# Altium schematic sheet Connector.SchDoc
size A4; Organization: PERT; SheetNumber: 3; SheetTotal: 3; Sub Team: EEE
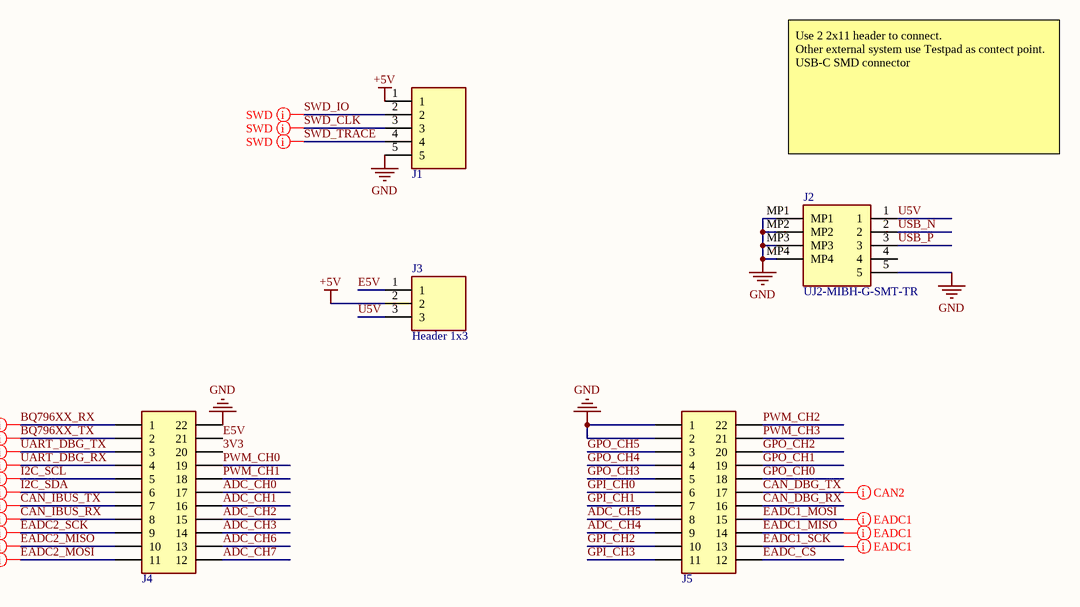
[diagram p0: Connector.SchDoc]

## Parts
J1  Header 1x5  [HDR_1X5_2.54_SMD]  (value not drawn)
J2  UJ2-MIBH-G-SMT-TR  [USB_B_5P_SMD]
J3  Header 1x3  [HDR_1X3_2.54_THD]
J4  Header 1x5  [HDR_2x11_2.54_THD]  (value not drawn)
J5  Header 1x5  [HDR_2x11_2.54_THD]  (value not drawn)

## Nets
+5V: J1.1 J3.2
GND: J1.5 J2.5 J2.MP1 J2.MP2 J2.MP3 J2.MP4 J4.22 J5.1 J5.2
3V3: J4.20
ADC_CH0: J4.17
ADC_CH1: J4.16
ADC_CH2: J4.15
ADC_CH3: J4.14
ADC_CH4: J5.9
ADC_CH5: J5.8
ADC_CH6: J4.13
ADC_CH7: J4.12
BQ796XX_RX: J4.1
BQ796XX_TX: J4.2
CAN_DBG_RX: J5.16
CAN_DBG_TX: J5.17
CAN_IBUS_RX: J4.8
CAN_IBUS_TX: J4.7
E5V: J3.1 J4.21
EADC1_MISO: J5.14
EADC1_MOSI: J5.15
EADC1_SCK: J5.13
EADC2_MISO: J4.10
EADC2_MOSI: J4.11
EADC2_SCK: J4.9
EADC_CS: J5.12
GPI_CH0: J5.6
GPI_CH1: J5.7
GPI_CH2: J5.10
GPI_CH3: J5.11
GPO_CH0: J5.18
GPO_CH1: J5.19
GPO_CH2: J5.20
GPO_CH3: J5.5
GPO_CH4: J5.4
GPO_CH5: J5.3
I2C_SCL: J4.5
I2C_SDA: J4.6
PWM_CH0: J4.19
PWM_CH1: J4.18
PWM_CH2: J5.22
PWM_CH3: J5.21
SWD_CLK: J1.3
SWD_IO: J1.2
SWD_TRACE: J1.4
U5V: J2.1 J3.3
UART_DBG_RX: J4.4
UART_DBG_TX: J4.3
USB_N: J2.2
USB_P: J2.3

Not connected (* = marked no-connect by the designer): J2 4

## Layout directives
net class UART2; rule Matched Net Lengths [Tolerance = 1mm]: UART_DBG_RX, UART_DBG_TX
net class UART1; rule Matched Net Lengths [Tolerance = 1mm]: BQ796XX_RX, BQ796XX_TX
net class I2C; rule Matched Net Lengths [Tolerance = 1mm]: I2C_SCL, I2C_SDA
net class SWD; rule Matched Net Lengths [Tolerance = 1mm]: SWD_CLK, SWD_IO, SWD_TRACE
net class EADC1; rule Matched Net Lengths [Tolerance = 1mm]: EADC1_MISO, EADC1_MOSI, EADC1_SCK
net class EADC2; rule Matched Net Lengths [Tolerance = 1mm]: EADC2_MISO, EADC2_MOSI, EADC2_SCK
net class CAN1; rule Differential Pairs Routing [Pref Gap = 0.254mm    Min Gap  = 0.127mm    Max Gap  = 0.254mmPref Width = 0.254mm    Min Width  = 0.127mm    Max Width  = 0.381mm]; rule Matched Net Lengths [Tolerance = 1mm]: CAN_IBUS_RX, CAN_IBUS_TX
net class CAN2; rule Differential Pairs Routing [Pref Gap = 0.254mm    Min Gap  = 0.127mm    Max Gap  = 0.254mmPref Width = 0.254mm    Min Width  = 0.127mm    Max Width  = 0.381mm]; rule Matched Net Lengths [Tolerance = 1mm]: CAN_DBG_TX

## Notes on the sheet
- Use 2 2x11 header to connect.
  Other external system use Testpad as contect point.
  USB-C SMD connector
- Title
- Generation
- Organization
- Sub Team
- Module
- Ver.
- Rev.
- Date
- Drawn By

## Library data of the parts
J1 = Header 1x5: Manufacturer_Name: TE Connectivity; Manufacturer_Part_Number: 87224-5; Geometry.Height: 10.745mm; Datasheet Link: https://www.arrow.com/en/products/87224-5/te-connectivity
J2 = USB_B 5P: USB Connectors USB jack, 2.0, micro B type, 5 pin, horizontal, gold flash, SMT, TR; Manufacturer_Name: CUI Devices; Geometry.Height: 3.15mm; Mouser Part Number: 490-UJ2-MIBH-G-SMTTR; Mouser Price/Stock: https://www.mouser.co.uk/ProductDetail/CUI-Devices/UJ2-MIBH-G-SMT-TR?qs=IS%252B4QmGtzzpvS1XQusp0iA%3D%3D; Manufacturer_Part_Number: UJ2-MIBH-G-SMT-TR; Datasheet Link: cuidevices.com/product/resource/uj2-mibh-g-smt-tr.pdf
J3 = Header 1x3: Pin Header 2.54mm Pitch STR DIP, 1x3Pin, G/F, LCP, 8.08mm*2.54mm*3.18mm, Color-Black, Bag; Manufacturer_Name: Amphenol Communications Solutions; Manufacturer_Part_Number: G800LR305018EU; Geometry.Height: 10.82mm; Mouser Part Number: 523-G800LR305018EU; Mouser Price/Stock: https://www.mouser.co.uk/ProductDetail/Amphenol-Commercial-Products/G800LR305018EU?qs=PzGy0jfpSMsZaVkTJmYyRA%3D%3D; Datasheet Link: https://cdn.amphenol-cs.com/media/wysiwyg/files/drawing/g800lrxxxxxxeu_1.pdf
J4 J5 = Header 2x11: Geometry.Height: 10.745mm